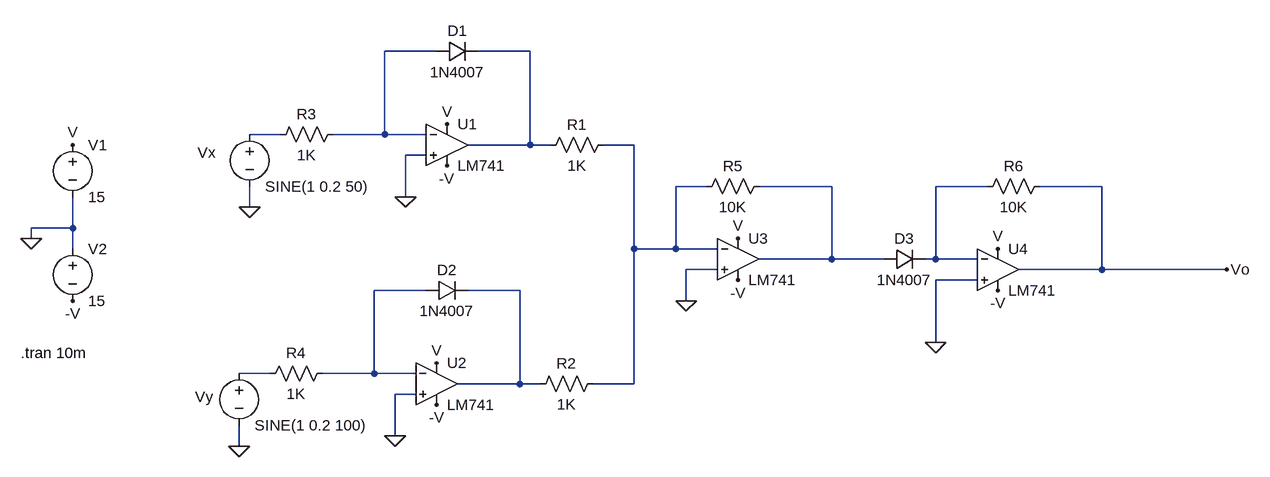
[diagram p0: schematic Multiplier2.asc]
Multiplier2.asc, the LTspice schematic file:
Version 4
SHEET 1 1232 680
WIRE -32 -480 -112 -480
WIRE 112 -480 32 -480
WIRE -272 -352 -320 -352
WIRE -112 -352 -112 -480
WIRE -112 -352 -192 -352
WIRE -48 -352 -112 -352
WIRE 112 -336 112 -480
WIRE 112 -336 16 -336
WIRE 144 -336 112 -336
WIRE 272 -336 224 -336
WIRE -48 -320 -80 -320
WIRE 384 -272 336 -272
WIRE 576 -272 464 -272
WIRE 816 -272 736 -272
WIRE 992 -272 896 -272
WIRE -80 -256 -80 -320
WIRE -320 -240 -320 -272
WIRE -592 -208 -592 -256
WIRE -592 -208 -656 -208
WIRE -656 -192 -656 -208
WIRE -592 -176 -592 -208
WIRE 272 -176 272 -336
WIRE 336 -176 336 -272
WIRE 336 -176 272 -176
WIRE 400 -176 336 -176
WIRE 576 -160 576 -272
WIRE 576 -160 464 -160
WIRE 656 -160 576 -160
WIRE 736 -160 736 -272
WIRE 736 -160 720 -160
WIRE 800 -160 736 -160
WIRE 400 -144 352 -144
WIRE 992 -144 992 -272
WIRE 992 -144 864 -144
WIRE 1184 -144 992 -144
WIRE 800 -128 736 -128
WIRE -48 -112 -128 -112
WIRE 96 -112 16 -112
WIRE 352 -96 352 -144
WIRE 736 -32 736 -128
WIRE -288 16 -336 16
WIRE -128 16 -128 -112
WIRE -128 16 -208 16
WIRE -64 16 -128 16
WIRE 96 32 96 -112
WIRE 96 32 0 32
WIRE 128 32 96 32
WIRE 272 32 272 -176
WIRE 272 32 208 32
WIRE -64 48 -96 48
WIRE -96 112 -96 48
WIRE -336 128 -336 96
FLAG -80 -256 0
FLAG -656 -192 0
FLAG -592 -336 V
FLAG -592 -96 -V
FLAG -16 -368 V
FLAG -16 -304 -V
FLAG -320 -240 0
FLAG -96 112 0
FLAG -32 0 V
FLAG -32 64 -V
FLAG -336 128 0
FLAG 352 -96 0
FLAG 432 -192 V
FLAG 432 -128 -V
FLAG 832 -176 V
FLAG 832 -112 -V
FLAG 736 -32 0
FLAG 1184 -144 Vo
SYMBOL OpAmps\\LM741 -16 -400 R0
SYMATTR InstName U1
SYMBOL voltage -592 -352 R0
WINDOW 123 0 0 Left 0
WINDOW 39 0 0 Left 0
SYMATTR InstName V1
SYMATTR Value 15
SYMBOL voltage -592 -192 R0
WINDOW 123 0 0 Left 0
WINDOW 39 0 0 Left 0
SYMATTR InstName V2
SYMATTR Value 15
SYMBOL res 240 -352 R90
WINDOW 0 0 56 VBottom 2
WINDOW 3 32 56 VTop 2
SYMATTR InstName R1
SYMATTR Value 1K
SYMBOL res -176 -368 R90
WINDOW 0 0 56 VBottom 2
WINDOW 3 32 56 VTop 2
SYMATTR InstName R3
SYMATTR Value 1K
SYMBOL voltage -320 -368 R0
WINDOW 0 -80 44 Left 2
WINDOW 123 0 0 Left 0
WINDOW 39 0 0 Left 0
SYMATTR InstName Vx
SYMATTR Value SINE(1 0.2 50)
SYMBOL diode -32 -464 R270
WINDOW 0 32 32 VTop 2
WINDOW 3 0 32 VBottom 2
SYMATTR InstName D1
SYMATTR Value 1N4007
SYMBOL OpAmps\\LM741 -32 -32 R0
SYMATTR InstName U2
SYMBOL res 224 16 R90
WINDOW 0 0 56 VBottom 2
WINDOW 3 32 56 VTop 2
SYMATTR InstName R2
SYMATTR Value 1K
SYMBOL res -192 0 R90
WINDOW 0 0 56 VBottom 2
WINDOW 3 32 56 VTop 2
SYMATTR InstName R4
SYMATTR Value 1K
SYMBOL voltage -336 0 R0
WINDOW 0 -68 52 Left 2
WINDOW 123 0 0 Left 0
WINDOW 39 0 0 Left 0
SYMATTR InstName Vy
SYMATTR Value SINE(1 0.2 100)
SYMBOL diode -48 -96 R270
WINDOW 0 32 32 VTop 2
WINDOW 3 0 32 VBottom 2
SYMATTR InstName D2
SYMATTR Value 1N4007
SYMBOL OpAmps\\LM741 432 -224 R0
SYMATTR InstName U3
SYMBOL res 480 -288 R90
WINDOW 0 0 56 VBottom 2
WINDOW 3 32 56 VTop 2
SYMATTR InstName R5
SYMATTR Value 10K
SYMBOL diode 656 -144 R270
WINDOW 0 32 32 VTop 2
WINDOW 3 0 32 VBottom 2
SYMATTR InstName D3
SYMATTR Value 1N4007
SYMBOL OpAmps\\LM741 832 -208 R0
SYMATTR InstName U4
SYMBOL res 912 -288 R90
WINDOW 0 0 56 VBottom 2
WINDOW 3 32 56 VTop 2
SYMATTR InstName R6
SYMATTR Value 10K
TEXT -672 -16 Left 2 !.tran 10m

The netlist it stands for:
* Multiplier2.asc
XU1 0 N001 V -V N002 LM741  ; pins In+ In- V+ V- OUT
V1 V 0 15
V2 0 -V 15
R1 N004 N002 1K
R3 N001 N003 1K
Vx N003 0 SINE(1 0.2 50)
D1 N001 N002 1N4007
XU2 0 N007 V -V N008 LM741  ; pins In+ In- V+ V- OUT
R2 N004 N008 1K
R4 N007 N009 1K
Vy N009 0 SINE(1 0.2 100)
D2 N007 N008 1N4007
XU3 0 N004 V -V N005 LM741  ; pins In+ In- V+ V- OUT
R5 N005 N004 10K
D3 N005 N006 1N4007
XU4 0 N006 V -V Vo LM741  ; pins In+ In- V+ V- OUT
R6 Vo N006 10K
.model D D
.lib standard.dio
.tran 10m
.lib LM741.lib
.backanno
.end